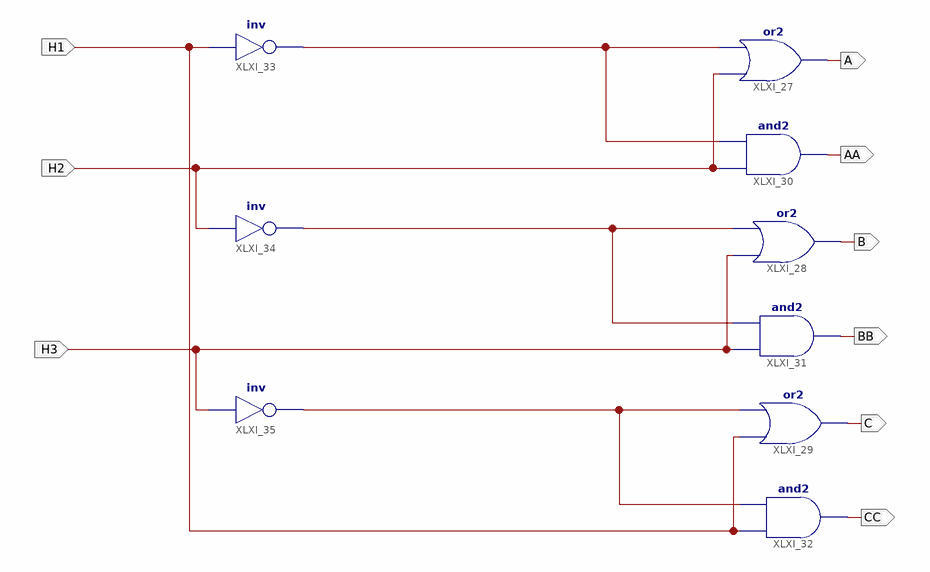
[diagram p0: schematic sheet 1]
// Xilinx ISE schematic Commutation.sch (spartan3e) as structural Verilog: 9 symbols, 9 ports
module Commutation (
  input  H2,
  input  H3,
  input  H1,
  output A,
  output AA,
  output B,
  output BB,
  output C,
  output CC
);

  wire XLXN_52, XLXN_54, XLXN_56;

  or XLXI_27 (A, H2, XLXN_52);
  or XLXI_28 (B, H3, XLXN_54);
  or XLXI_29 (C, H1, XLXN_56);
  and XLXI_30 (AA, H2, XLXN_52);
  and XLXI_31 (BB, H3, XLXN_54);
  and XLXI_32 (CC, H1, XLXN_56);
  not XLXI_33 (XLXN_52, H1);
  not XLXI_34 (XLXN_54, H2);
  not XLXI_35 (XLXN_56, H3);
endmodule
